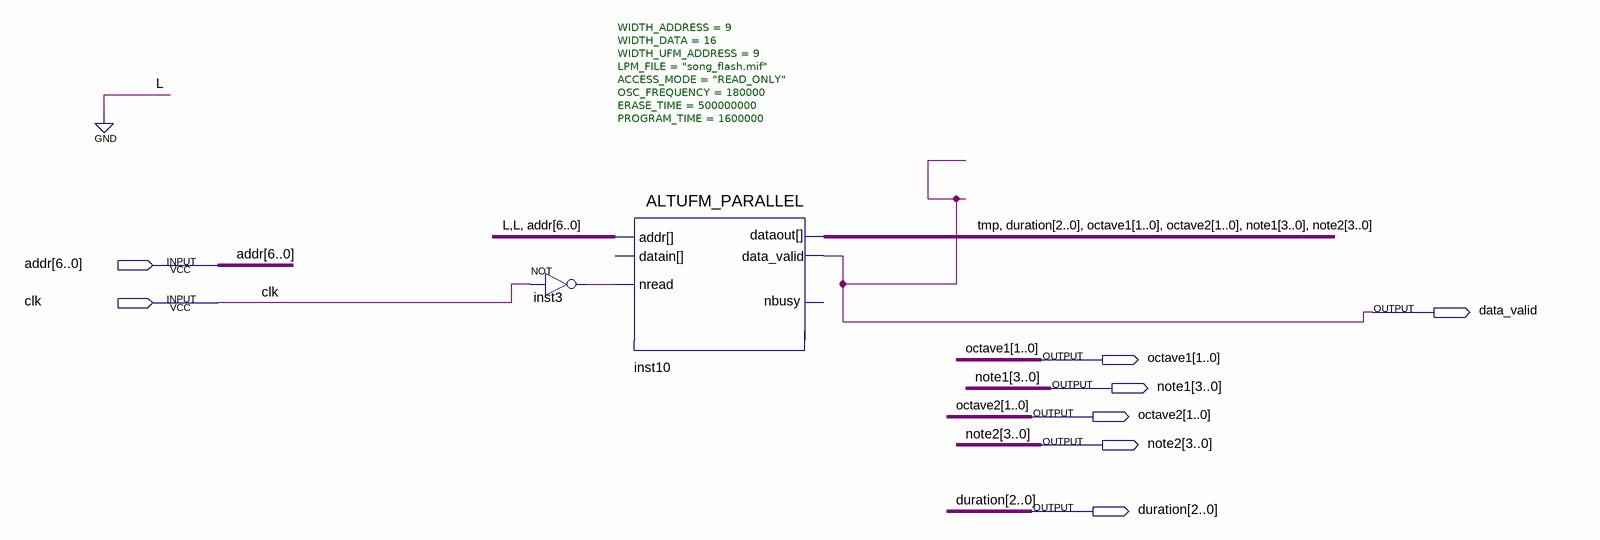
[diagram p0: schematic sheet]
// Quartus schematic flash_ROM.bdf as structural Verilog: 2 symbols, 8 pins
module flash_ROM (
  input  [6:0] addr,
  input  clk,
  output data_valid,
  output [1:0] octave1,
  output [3:0] note1,
  output [1:0] octave2,
  output [3:0] note2,
  output [2:0] duration
);

  wire inst3_out, tmp;

  not inst3 (inst3_out, clk);
  ALTUFM_PARALLEL #(.WIDTH_ADDRESS(9), .WIDTH_DATA(16), .WIDTH_UFM_ADDRESS(9), .LPM_FILE("song_flash.mif"), .ACCESS_MODE("READ_ONLY"), .OSC_FREQUENCY(180000), .ERASE_TIME(500000000), .PROGRAM_TIME(1600000)) inst10 (
    .addr({2'b00, addr}), .nread(inst3_out), .data_valid(data_valid),
    .dataout({tmp, duration, octave1, octave2, note1, note2}));  // open: datain, nbusy
endmodule
